# EAGLE schematic ptn (EAGLE 5.06)
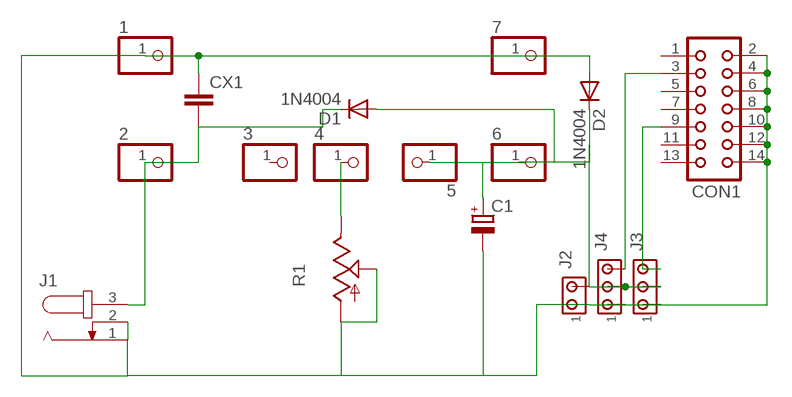
[diagram p0: schematic, sheet 1]

## Parts
1  PINHD-1X1  [1X01]
2  PINHD-1X1  [1X01]
3  PINHD-1X1  [1X01]
4  PINHD-1X1  [1X01]
5  PINHD-1X1  [1X01]
6  PINHD-1X1  [1X01]
7  PINHD-1X1  [1X01]
C1  CPOL-EUE5-13  [E5-13]
CON1  CON14  [CON14]
CX1  CXXC15B10  [XC15B10]
D1  1N4004  [DO41-10]
D2  1N4004  [DO41-10]
J1  JACK-PLUG1  [SPC4078]
J2  MTA02-100  [10X02MTA]
J3  MTA03-100  [10X03MTA]
J4  MTA03-100  [10X03MTA]
R1  TRIM_US-B64Y  [B64Y]

## Nets
N$1: 2.1 CX1.2 D1.C J1.3
N$2: CON1.3 J4.3
N$3: CON1.9 J3.3
N$5: 4.1 R1.E
N$7: 1.1 7.1 C1.- CON1.2 CON1.4 CON1.6 CON1.8 CON1.10 CON1.12 CON1.14 CX1.1 D2.A J1.1 J1.2 J2.1 J3.1 J4.1 R1.A R1.S
N$8: 5.1 6.1 C1.+ D1.A D2.C J2.2 J3.2 J4.2
Unconnected: 3.1 CON1.1 CON1.5 CON1.7 CON1.11 CON1.13

## Library data of the parts
1-7 = pinhead:PINHD-1X1: PIN HEADER
C1 = rcl:CPOL-EU: POLARIZED CAPACITOR, European symbol
CON1 = con-harting:CON14: CONNECTOR
CX1 = rcl:CX: X CAPACITOR for power line
D1 D2 = diode:1N4004: DIODE general purpose rectifier, 1 A
J1 = con-jack:JACK-PLUG: DC POWER JACK Power Jack, DC, Right Angle, Through Hole, Rated 5A at 16VDC, PC Terminals Distributor: Farnell (www.Farnell.de) Drawing: 84N1161.pdf / 84N1162.pdf Manufacturer: SPC Technology (www.spctechnology.com) Type: SPC4077 / SPC 4078
J2 = con-amp:MTA02-100: AMP connector
J3 J4 = con-amp:MTA03-100: AMP connector
R1 = pot:TRIM_US-: POTENTIOMETER